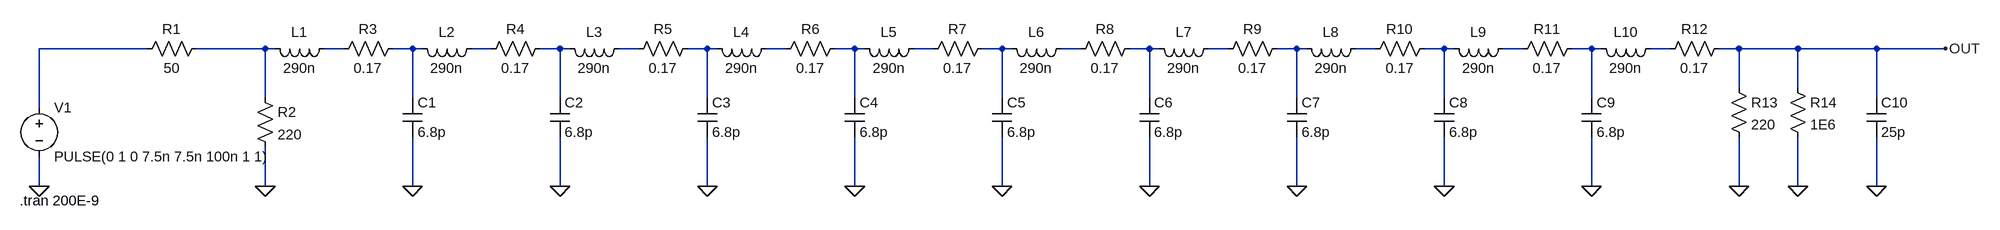
[diagram p0: schematic 10 cell.asc]
10 cell.asc, the LTspice schematic file:
Version 4
SHEET 1 3140 680
WIRE 144 48 -32 48
WIRE 336 48 224 48
WIRE 352 48 336 48
WIRE 464 48 432 48
WIRE 576 48 544 48
WIRE 592 48 576 48
WIRE 704 48 672 48
WIRE 816 48 784 48
WIRE 832 48 816 48
WIRE 944 48 912 48
WIRE 1056 48 1024 48
WIRE 1072 48 1056 48
WIRE 1184 48 1152 48
WIRE 1296 48 1264 48
WIRE 1312 48 1296 48
WIRE 1424 48 1392 48
WIRE 1536 48 1504 48
WIRE 1552 48 1536 48
WIRE 1664 48 1632 48
WIRE 1776 48 1744 48
WIRE 1792 48 1776 48
WIRE 1904 48 1872 48
WIRE 2016 48 1984 48
WIRE 2032 48 2016 48
WIRE 2144 48 2112 48
WIRE 2256 48 2224 48
WIRE 2272 48 2256 48
WIRE 2384 48 2352 48
WIRE 2496 48 2464 48
WIRE 2512 48 2496 48
WIRE 2624 48 2592 48
WIRE 2736 48 2704 48
WIRE 2832 48 2736 48
WIRE 2960 48 2832 48
WIRE 3072 48 2960 48
WIRE 2736 112 2736 48
WIRE 2832 112 2832 48
WIRE 336 128 336 48
WIRE 576 128 576 48
WIRE 816 128 816 48
WIRE 1056 128 1056 48
WIRE 1296 128 1296 48
WIRE 1536 128 1536 48
WIRE 1776 128 1776 48
WIRE 2016 128 2016 48
WIRE 2256 128 2256 48
WIRE 2496 128 2496 48
WIRE 2960 128 2960 48
WIRE -32 144 -32 48
WIRE -32 272 -32 224
WIRE 336 272 336 208
WIRE 576 272 576 192
WIRE 816 272 816 192
WIRE 1056 272 1056 192
WIRE 1296 272 1296 192
WIRE 1536 272 1536 192
WIRE 1776 272 1776 192
WIRE 2016 272 2016 192
WIRE 2256 272 2256 192
WIRE 2496 272 2496 192
WIRE 2736 272 2736 192
WIRE 2832 272 2832 192
WIRE 2960 272 2960 192
FLAG -32 272 0
FLAG 336 272 0
FLAG 576 272 0
FLAG 816 272 0
FLAG 1056 272 0
FLAG 1296 272 0
FLAG 1536 272 0
FLAG 1776 272 0
FLAG 2016 272 0
FLAG 2256 272 0
FLAG 2496 272 0
FLAG 2736 272 0
FLAG 2832 272 0
FLAG 2960 272 0
FLAG 3072 48 OUT
SYMBOL voltage -32 128 R0
WINDOW 123 0 0 Left 0
WINDOW 39 0 0 Left 0
SYMATTR InstName V1
SYMATTR Value PULSE(0 1 0 7.5n 7.5n 100n 1 1)
SYMBOL res 240 32 R90
WINDOW 0 0 56 VBottom 2
WINDOW 3 32 56 VTop 2
SYMATTR InstName R1
SYMATTR Value 50
SYMBOL res 320 112 R0
SYMATTR InstName R2
SYMATTR Value 220
SYMBOL ind 448 32 R90
WINDOW 0 5 56 VBottom 2
WINDOW 3 32 56 VTop 2
SYMATTR InstName L1
SYMATTR Value 290n
SYMBOL res 560 32 R90
WINDOW 0 0 56 VBottom 2
WINDOW 3 32 56 VTop 2
SYMATTR InstName R3
SYMATTR Value 0.17
SYMBOL cap 560 128 R0
SYMATTR InstName C1
SYMATTR Value 6.8p
SYMBOL ind 688 32 R90
WINDOW 0 5 56 VBottom 2
WINDOW 3 32 56 VTop 2
SYMATTR InstName L2
SYMATTR Value 290n
SYMBOL res 800 32 R90
WINDOW 0 0 56 VBottom 2
WINDOW 3 32 56 VTop 2
SYMATTR InstName R4
SYMATTR Value 0.17
SYMBOL cap 800 128 R0
SYMATTR InstName C2
SYMATTR Value 6.8p
SYMBOL ind 928 32 R90
WINDOW 0 5 56 VBottom 2
WINDOW 3 32 56 VTop 2
SYMATTR InstName L3
SYMATTR Value 290n
SYMBOL res 1040 32 R90
WINDOW 0 0 56 VBottom 2
WINDOW 3 32 56 VTop 2
SYMATTR InstName R5
SYMATTR Value 0.17
SYMBOL cap 1040 128 R0
SYMATTR InstName C3
SYMATTR Value 6.8p
SYMBOL ind 1168 32 R90
WINDOW 0 5 56 VBottom 2
WINDOW 3 32 56 VTop 2
SYMATTR InstName L4
SYMATTR Value 290n
SYMBOL res 1280 32 R90
WINDOW 0 0 56 VBottom 2
WINDOW 3 32 56 VTop 2
SYMATTR InstName R6
SYMATTR Value 0.17
SYMBOL cap 1280 128 R0
SYMATTR InstName C4
SYMATTR Value 6.8p
SYMBOL ind 1408 32 R90
WINDOW 0 5 56 VBottom 2
WINDOW 3 32 56 VTop 2
SYMATTR InstName L5
SYMATTR Value 290n
SYMBOL res 1520 32 R90
WINDOW 0 0 56 VBottom 2
WINDOW 3 32 56 VTop 2
SYMATTR InstName R7
SYMATTR Value 0.17
SYMBOL cap 1520 128 R0
SYMATTR InstName C5
SYMATTR Value 6.8p
SYMBOL ind 1648 32 R90
WINDOW 0 5 56 VBottom 2
WINDOW 3 32 56 VTop 2
SYMATTR InstName L6
SYMATTR Value 290n
SYMBOL res 1760 32 R90
WINDOW 0 0 56 VBottom 2
WINDOW 3 32 56 VTop 2
SYMATTR InstName R8
SYMATTR Value 0.17
SYMBOL cap 1760 128 R0
SYMATTR InstName C6
SYMATTR Value 6.8p
SYMBOL ind 1888 32 R90
WINDOW 0 5 56 VBottom 2
WINDOW 3 32 56 VTop 2
SYMATTR InstName L7
SYMATTR Value 290n
SYMBOL res 2000 32 R90
WINDOW 0 0 56 VBottom 2
WINDOW 3 32 56 VTop 2
SYMATTR InstName R9
SYMATTR Value 0.17
SYMBOL cap 2000 128 R0
SYMATTR InstName C7
SYMATTR Value 6.8p
SYMBOL ind 2128 32 R90
WINDOW 0 5 56 VBottom 2
WINDOW 3 32 56 VTop 2
SYMATTR InstName L8
SYMATTR Value 290n
SYMBOL res 2240 32 R90
WINDOW 0 0 56 VBottom 2
WINDOW 3 32 56 VTop 2
SYMATTR InstName R10
SYMATTR Value 0.17
SYMBOL cap 2240 128 R0
SYMATTR InstName C8
SYMATTR Value 6.8p
SYMBOL ind 2368 32 R90
WINDOW 0 5 56 VBottom 2
WINDOW 3 32 56 VTop 2
SYMATTR InstName L9
SYMATTR Value 290n
SYMBOL res 2480 32 R90
WINDOW 0 0 56 VBottom 2
WINDOW 3 32 56 VTop 2
SYMATTR InstName R11
SYMATTR Value 0.17
SYMBOL cap 2480 128 R0
SYMATTR InstName C9
SYMATTR Value 6.8p
SYMBOL ind 2608 32 R90
WINDOW 0 5 56 VBottom 2
WINDOW 3 32 56 VTop 2
SYMATTR InstName L10
SYMATTR Value 290n
SYMBOL res 2720 32 R90
WINDOW 0 0 56 VBottom 2
WINDOW 3 32 56 VTop 2
SYMATTR InstName R12
SYMATTR Value 0.17
SYMBOL res 2720 96 R0
SYMATTR InstName R13
SYMATTR Value 220
SYMBOL res 2816 96 R0
SYMATTR InstName R14
SYMATTR Value 1E6
SYMBOL cap 2944 128 R0
SYMATTR InstName C10
SYMATTR Value 25p
TEXT -64 296 Left 2 !.tran 200E-9

The netlist it stands for:
* 10 cell.asc
V1 N001 0 PULSE(0 1 0 7.5n 7.5n 100n 1 1)
R1 N002 N001 50
R2 N002 0 220
L1 N003 N002 290n
R3 N004 N003 0.17
C1 N004 0 6.8p
L2 N005 N004 290n
R4 N006 N005 0.17
C2 N006 0 6.8p
L3 N007 N006 290n
R5 N008 N007 0.17
C3 N008 0 6.8p
L4 N009 N008 290n
R6 N010 N009 0.17
C4 N010 0 6.8p
L5 N011 N010 290n
R7 N012 N011 0.17
C5 N012 0 6.8p
L6 N013 N012 290n
R8 N014 N013 0.17
C6 N014 0 6.8p
L7 N015 N014 290n
R9 N016 N015 0.17
C7 N016 0 6.8p
L8 N017 N016 290n
R10 N018 N017 0.17
C8 N018 0 6.8p
L9 N019 N018 290n
R11 N020 N019 0.17
C9 N020 0 6.8p
L10 N021 N020 290n
R12 OUT N021 0.17
R13 OUT 0 220
R14 OUT 0 1E6
C10 OUT 0 25p
.tran 200E-9
.backanno
.end